# Altium schematic sheet Sheet1.SchDoc
size A3; PageSetup: Record=PageOptions|CenterHorizontal=True|CenterVertical=True|PrintScale=0.70|XCorrection=1.00|YCorrection=1.00|PrintKind=1|BorderSize=5000000|LeftOffset=0|BottomOffset=0|Orientation=2|PaperLength=1000|PaperWidth=1000|Scale=100|PaperSource=7|PrintQuality=-3|MediaType=1|DitherType=10|PrintScaleMode=1|PaperKind=Letter|PaperIndex=1
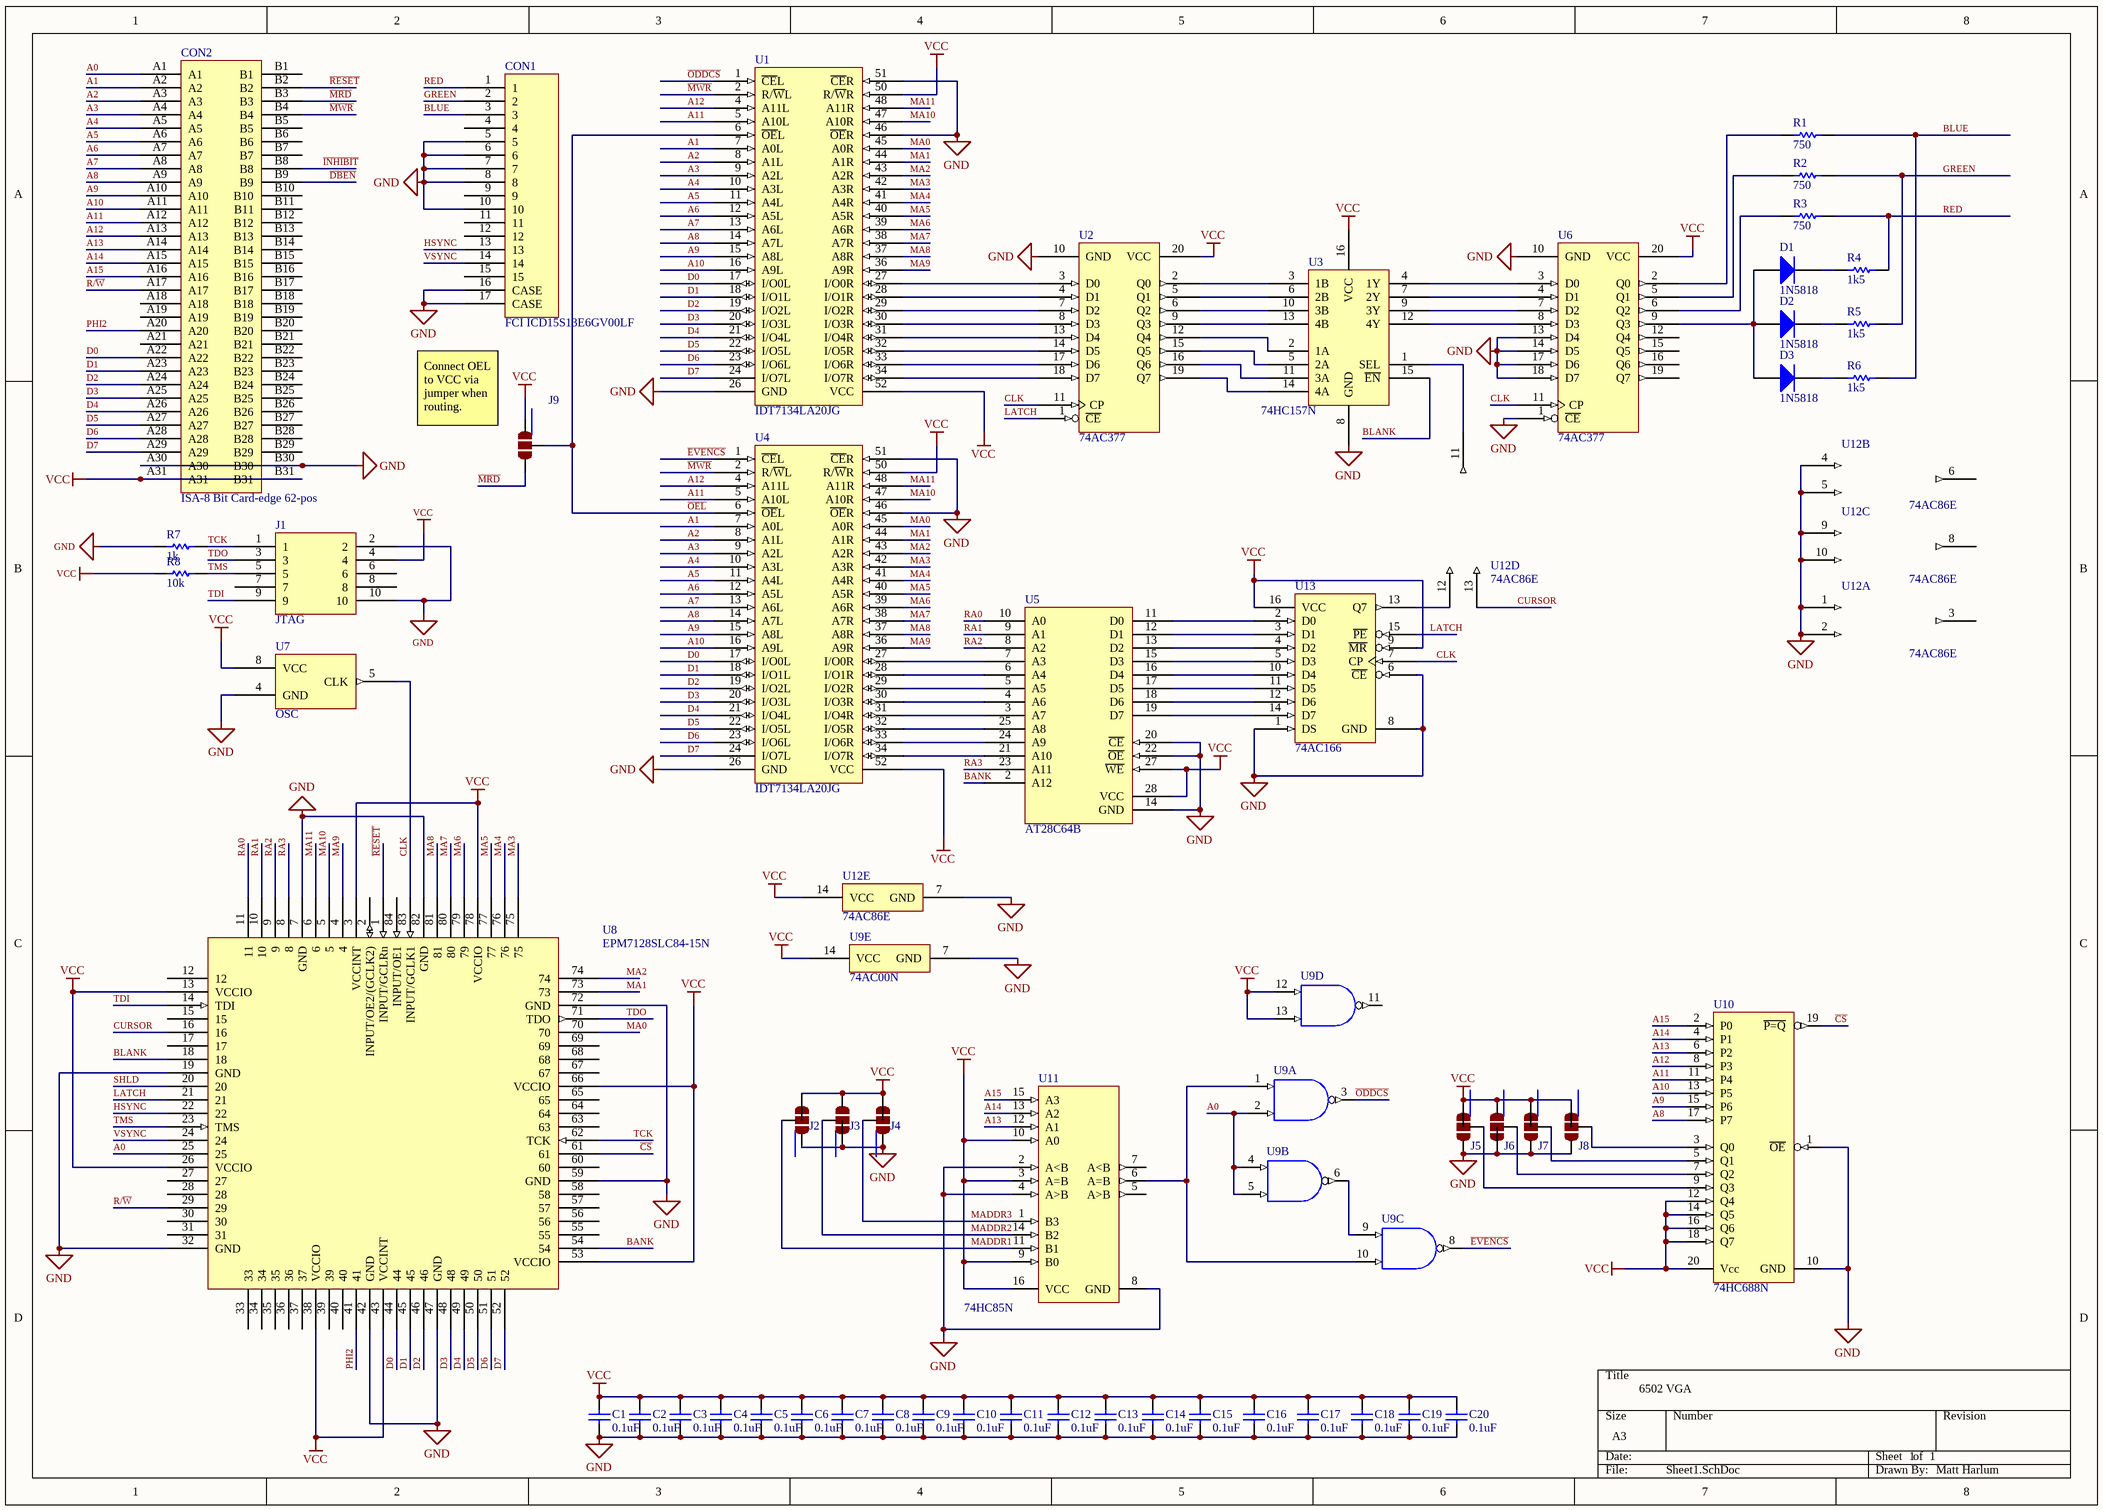
[diagram p0: Sheet1.SchDoc]

## Parts
(Parts that share a designator on the sheet are numbered #1, #2 ... from top to bottom, then left to right.)
C1  0.1uF  [PCB-axqyt61qy3lylbxfyoas-1]
C2  0.1uF  [PCB-axqyt61qy3lylbxfyoas-1]
C3  0.1uF  [PCB-axqyt61qy3lylbxfyoas-1]
C4  0.1uF  [PCB-axqyt61qy3lylbxfyoas-1]
C5  0.1uF  [PCB-axqyt61qy3lylbxfyoas-1]
C6  0.1uF  [PCB-axqyt61qy3lylbxfyoas-1]
C7  0.1uF  [PCB-axqyt61qy3lylbxfyoas-1]
C8  0.1uF  [PCB-axqyt61qy3lylbxfyoas-1]
C9  0.1uF  [PCB-axqyt61qy3lylbxfyoas-1]
C10  0.1uF  [PCB-axqyt61qy3lylbxfyoas-1]
C11  0.1uF  [CAPC1608X90X35LL15T15]
C12  0.1uF  [CAPC1608X90X35LL15T15]
C13  0.1uF  [CAPC1608X90X35LL15T15]
C14  0.1uF  [CAPC1608X90X35LL15T15]
C15  0.1uF  [CAPC1608X90X35LL15T15]
C16  0.1uF  [CAPC1608X90X35LL15T15]
C17  0.1uF  [CAPC1608X90X35LL15T15]
C18  0.1uF  [CAPC1608X90X35LL15T15]
C19  0.1uF  [PCB-axqyt61qy3lylbxfyoas-1]
C20  0.1uF  [PCB-axqyt61qy3lylbxfyoas-1]
CON1  FCI ICD15S13E6GV00LF  [PCB-aanmvvjyo9awk9gcg6zf-1]
CON2  ISA-8 Bit Card-edge 62-pos  [PCB-2hkdxqdttofatkmr091c-1]
D1  1N5818  [PCB-dmqzmbtm0hfd5zoh45h0-1]
D2  1N5818  [PCB-dmqzmbtm0hfd5zoh45h0-1]
D3  1N5818  [PCB-dmqzmbtm0hfd5zoh45h0-1]
J1  JTAG  [PCB-nsgmebcr356so910k4yq-1]
J2  Solder Jumper 2-way  [PCB-rrnqmtokqinrd1vbp5jt-1]  (value not drawn)
J3  Solder Jumper 2-way  [PCB-rrnqmtokqinrd1vbp5jt-1]  (value not drawn)
J4  Solder Jumper 2-way  [PCB-rrnqmtokqinrd1vbp5jt-1]  (value not drawn)
J5  Solder Jumper 2-way  [PCB-rrnqmtokqinrd1vbp5jt-1]  (value not drawn)
J6  Solder Jumper 2-way  [PCB-rrnqmtokqinrd1vbp5jt-1]  (value not drawn)
J7  Solder Jumper 2-way  [PCB-rrnqmtokqinrd1vbp5jt-1]  (value not drawn)
J8  Solder Jumper 2-way  [PCB-rrnqmtokqinrd1vbp5jt-1]  (value not drawn)
J9  Solder Jumper 2-way  [PCB-rrnqmtokqinrd1vbp5jt-1]  (value not drawn)
R1  750  [PCB-rpsft8201oy38h4ywt2t-1]
R2  750  [PCB-rpsft8201oy38h4ywt2t-1]
R3  750  [PCB-rpsft8201oy38h4ywt2t-1]
R4  1k5  [PCB-rpsft8201oy38h4ywt2t-1]
R5  1k5  [PCB-rpsft8201oy38h4ywt2t-1]
R6  1k5  [PCB-rpsft8201oy38h4ywt2t-1]
R7  1k  [PCB-rpsft8201oy38h4ywt2t-1]
R8  10k  [PCB-rpsft8201oy38h4ywt2t-1]
U1  IDT7134LA20JG  [PCB-4uhgbu29r3u9nc1ivwpw-1]
U2  74AC377  [SOIC-20]
U3  74HC157N  [PCB-8geuhk1ja2dgvs6cgerq-1]
U4  IDT7134LA20JG  [PCB-4uhgbu29r3u9nc1ivwpw-1]
U5  AT28C64B  [PCB-0g11s820xjhkjlfxzqv3-1]
U6  74AC377  [SOIC-20]
U7  OSC  [PCBComponent_1 - duplicate]
U8  EPM7128SLC84-15N  [PCB-0riewn8x9vsccxvjjlmn-1]
U9#1  74AC00N  [PCB-iqlzed4p26o3dln4s1xn-1]  (part E of 5)
U9#2  74AC00N  [PCB-iqlzed4p26o3dln4s1xn-1]  (value not drawn)  (parts A,B,C,D of 5)
U10  74HC688N  [PCB-uzpsivvelhpmz77y3dnk-1]
U11  74HC85N  [PCB-643w3ptt8l5hopz8bmjx-1]
U12  74AC86E  [DIP14]  (parts A,B,C,D,E of 5)
U13  74AC166  [DIP16]

## Nets
GND: C1.1 C2.1 C3.1 C4.1 C5.1 C6.1 C7.1 C8.1 C9.1 C10.1 C11.1 C12.1 C13.1 C14.1 C15.1 C16.1 C17.1 C18.1 C19.1 C20.1 CON1.5 CON1.6 CON1.7 CON1.8 CON1.10 CON1.16(CASE) CON1.17(CASE) CON2.A30 CON2.B30 J1.2 J1.10 J2.1 J3.1 J4.1 J5.3 J6.3 J7.3 J8.3 R7.1 U1.26(GND) U1.46(~{OE}R) U1.51(~{CE}R) U2.10(GND) U3.8(GND) U4.26(GND) U4.46(~{OE}R) U4.51(~{CE}R) U5.14(GND) U5.20(~{CE}) U5.22(~{OE}) U6.1(~{CE}) U6.10(GND) U6.13(D4) U6.14(D5) U6.17(D6) U6.18(D7) U7.4(GND) U8.7(GND) U8.19(GND) U8.32(GND) U8.42(GND) U8.47(GND) U8.59(GND) U8.72(GND) U8.82(GND) U9#1.7(GND) U10.1(~{OE}) U10.10(GND) U11.2(A<B) U11.4(A>B) U11.8(GND) U12.1(1A) U12.2(1B) U12.4(2A) U12.5(2B) U12.7(GND) U12.9(3A) U12.10(3B) U13.1(DS) U13.6(~{CE}) U13.8(GND)
VCC: C1.2 C2.2 C3.2 C4.2 C5.2 C6.2 C7.2 C8.2 C9.2 C10.2 C11.2 C12.2 C13.2 C14.2 C15.2 C16.2 C17.2 C18.2 C19.2 C20.2 CON2.A31 CON2.B31 J1.4 J2.3 J3.3 J4.3 J5.1 J6.1 J7.1 J8.1 J9.1 R8.1 U1.50(R/~{W}R) U1.52(VCC) U2.20(VCC) U3.16(VCC) U4.50(R/~{W}R) U4.52(VCC) U5.27(~{WE}) U5.28(VCC) U6.20(VCC) U7.8(VCC) U8.3(VCCINT) U8.13(VCCIO) U8.26(VCCIO) U8.38(VCCIO) U8.43(VCCINT) U8.53(VCCIO) U8.66(VCCIO) U8.78(VCCIO) U9#1.14(VCC) U9#2.12(4A) U9#2.13(4B) U10.12(Q4) U10.14(Q5) U10.16(Q6) U10.18(Q7) U10.20(Vcc) U11.3(A=B) U11.9(B0) U11.10(A0) U11.16(VCC) U12.14(VCC) U13.9(~{MR}) U13.16(VCC)
A0: CON2.A1 U8.25 U9#2.2(1B) U9#2.4(2A) U9#2.5(2B)
A1: CON2.A2 U1.7(A0L) U4.7(A0L)
A2: CON2.A3 U1.8(A1L) U4.8(A1L)
A3: CON2.A4 U1.9(A2L) U4.9(A2L)
A4: CON2.A5 U1.10(A3L) U4.10(A3L)
A5: CON2.A6 U1.11(A4L) U4.11(A4L)
A6: CON2.A7 U1.12(A5L) U4.12(A5L)
A7: CON2.A8 U1.13(A6L) U4.13(A6L)
A8: CON2.A9 U1.14(A7L) U4.14(A7L) U10.17(P7)
A9: CON2.A10 U1.15(A8L) U4.15(A8L) U10.15(P6)
A10: CON2.A11 U1.16(A9L) U4.16(A9L) U10.13(P5)
A11: CON2.A12 U1.5(A10L) U4.5(A10L) U10.11(P4)
A12: CON2.A13 U1.4(A11L) U4.4(A11L) U10.8(P3)
A13: CON2.A14 U10.6(P2) U11.12(A1)
A14: CON2.A15 U10.4(P1) U11.13(A2)
A15: CON2.A16 U10.2(P0) U11.15(A3)
BANK: U5.2(A12) U8.54
BLANK: U3.15(~{EN}) U8.18
BLUE: CON1.3 R1.2 R6.2
~{CS}: U8.61 U10.19(~{P=Q})
CLK: U2.11(CP) U6.11(CP) U7.5(CLK) U8.83(INPUT/GCLK1) U13.7(CP)
CURSOR: U8.16 U12.13(4B)
D0: CON2.A22 U1.17(I/O0L) U4.17(I/O0L) U8.44
D1: CON2.A23 U1.18(I/O1L) U4.18(I/O1L) U8.45
D2: CON2.A24 U1.19(I/O2L) U4.19(I/O2L) U8.46
D3: CON2.A25 U1.20(I/O3L) U4.20(I/O3L) U8.48
D4: CON2.A26 U1.21(I/O4L) U4.21(I/O4L) U8.49
D5: CON2.A27 U1.22(I/O5L) U4.22(I/O5L) U8.50
D6: CON2.A28 U1.23(I/O6L) U4.23(I/O6L) U8.51
D7: CON2.A29 U1.24(I/O7L) U4.24(I/O7L) U8.52
~{DBEN}: CON2.B9
~{EVENCS}: U4.1(~{CE}L) U9#2.8(~{3Y})
GREEN: CON1.2 R2.2 R5.2
HSYNC: CON1.13 U8.22
~{INHIBIT}: CON2.B8
LATCH: U2.1(~{CE}) U8.21 U13.15(~{PE})
~{MRD}: CON2.B3 J9.3
~{MWR}: CON2.B4 U1.2(R/~{W}L) U4.2(R/~{W}L)
MA0: U1.45(A0R) U4.45(A0R) U8.70
MA1: U1.44(A1R) U4.44(A1R) U8.73
MA2: U1.43(A2R) U4.43(A2R) U8.74
MA3: U1.42(A3R) U4.42(A3R) U8.75
MA4: U1.41(A4R) U4.41(A4R) U8.76
MA5: U1.40(A5R) U4.40(A5R) U8.77
MA6: U1.39(A6R) U4.39(A6R) U8.79
MA7: U1.38(A7R) U4.38(A7R) U8.80
MA8: U1.37(A8R) U4.37(A8R) U8.81
MA9: U1.36(A9R) U4.36(A9R) U8.4
MA10: U1.47(A10R) U4.47(A10R) U8.5
MA11: U1.48(A11R) U4.48(A11R) U8.6
MADDR1: J2.2 U11.11(B1)
MADDR2: J3.2 U11.14(B2)
MADDR3: J4.2 U11.1(B3)
~{ODDCS}: U1.1(~{CE}L) U9#2.3(~{1Y})
~{OEL}: J9.2 U1.6(~{OE}L) U4.6(~{OE}L)
PHI2: CON2.A20 U8.41
R/~{W}: CON2.A17 U8.29
~{RESET}: CON2.B2 U8.1(INPUT/GCLRn)
RA0: U5.10(A0) U8.11
RA1: U5.9(A1) U8.10
RA2: U5.8(A2) U8.9
RA3: U5.23(A11) U8.8
RED: CON1.1 R3.2 R4.2
SHLD: U8.20
TCK: J1.1 R7.2 U8.62(TCK)
TDI: J1.9 U8.14(TDI)
TDO: J1.3 U8.71(TDO)
TMS: J1.5 R8.2 U8.23(TMS)
VSYNC: CON1.14 U8.24
NetD1_1: D1.1(A) D2.1(A) D3.1(A) U6.9(Q3)
NetD1_2: D1.2(K) R4.1
NetD2_2: D2.2(K) R5.1
NetD3_2: D3.2(K) R6.1
NetJ5_2: J5.2 U10.9(Q3)
NetJ6_2: J6.2 U10.7(Q2)
NetJ7_2: J7.2 U10.5(Q1)
NetJ8_2: J8.2 U10.3(Q0)
NetR1_1: R1.1 U6.2(Q0)
NetR2_1: R2.1 U6.5(Q1)
NetR3_1: R3.1 U6.6(Q2)
NetU1_27: U1.27(I/O0R) U2.3(D0)
NetU1_28: U1.28(I/O1R) U2.4(D1)
NetU1_29: U1.29(I/O2R) U2.7(D2)
NetU1_30: U1.30(I/O3R) U2.8(D3)
NetU1_31: U1.31(I/O4R) U2.13(D4)
NetU1_32: U1.32(I/O5R) U2.14(D5)
NetU1_33: U1.33(I/O6R) U2.17(D6)
NetU1_34: U1.34(I/O7R) U2.18(D7)
NetU2_2: U2.2(Q0) U3.3(1B)
NetU2_5: U2.5(Q1) U3.6(2B)
NetU2_6: U2.6(Q2) U3.10(3B)
NetU2_9: U2.9(Q3) U3.13(4B)
NetU2_12: U2.12(Q4) U3.2(1A)
NetU2_15: U2.15(Q5) U3.5(2A)
NetU2_16: U2.16(Q6) U3.11(3A)
NetU2_19: U2.19(Q7) U3.14(4A)
NetU3_1: U3.1(SEL) U12.11(4Y)
NetU3_4: U3.4(1Y) U6.3(D0)
NetU3_7: U3.7(2Y) U6.4(D1)
NetU3_9: U3.9(3Y) U6.7(D2)
NetU3_12: U3.12(4Y) U6.8(D3)
NetU4_27: U4.27(I/O0R) U5.7(A3)
NetU4_28: U4.28(I/O1R) U5.6(A4)
NetU4_29: U4.29(I/O2R) U5.5(A5)
NetU4_30: U4.30(I/O3R) U5.4(A6)
NetU4_31: U4.31(I/O4R) U5.3(A7)
NetU4_32: U4.32(I/O5R) U5.25(A8)
NetU4_33: U4.33(I/O6R) U5.24(A9)
NetU4_34: U4.34(I/O7R) U5.21(A10)
NetU5_11: U5.11(D0) U13.2(D0)
NetU5_12: U5.12(D1) U13.3(D1)
NetU5_13: U5.13(D2) U13.4(D2)
NetU5_15: U5.15(D3) U13.5(D3)
NetU5_16: U5.16(D4) U13.10(D4)
NetU5_17: U5.17(D5) U13.11(D5)
NetU5_18: U5.18(D6) U13.12(D6)
NetU5_19: U5.19(D7) U13.14(D7)
NetU9#2_1: U9#2.1(1A) U9#2.10(3B) U11.6(A=B)
NetU9#2_6: U9#2.6(~{2Y}) U9#2.9(3A)
NetU12_12: U12.12(4A) U13.13(Q7)

Not connected (* = marked no-connect by the designer): CON1 4 9 11 12 15; CON2 A18 A19 A21 B1 B5 B6 B7 B10 B11 B12 B13 B14 B15 B16 B17 B18 B19 B20 B21 B22 B23 B24 B25 B26 B27 B28 B29; J1 6 7 8; U1 3(NC) 25(NC) 35(NC) 49(NC); U4 3(NC) 25(NC) 35(NC) 49(NC); U5 1(NC) 26(NC); U6 12(Q4) 15(Q5) 16(Q6) 19(Q7); U7 1(NC); U8 2(INPUT/OE2/(GCLK2)) 12 15 17 27 28 30 31 33 34 35 36 37 39 40 55 56 57 58 60 63 64 65 67 68 69 84(INPUT/OE1); U9#2 11(~{4Y}); U11 5(A>B) 7(A<B); U12 3(1Y) 6(2Y) 8(3Y)

## Notes on the sheet
- (near J9) Connect OEL to VCC via jumper when routing.
- 6502 VGA
- 1
- Matt Harlum

## Library data of the parts
C1-C10 C19 C20 = CMP-e4d32f8040453b14-8: Multilayer Ceramic Capacitor, Gold Max, C320 Series, 0.1 - F, - 10%, X7R, 50 V, Radial Leaded; Manufacturer Part Number: C320C104K5R5TA; Voltage Rating (DC): 50.0 V; Capacitance: 100 nF; Mounting Style: Radial; Dielectric Characteristic: X7R; REACH SVHC Compliance: No SVHC; RoHS: Compliant; Packaging: Bulk; Size-Height: 6.60 mm; Capacitance Tolerance: ±10%; Size-Length: 5.08 mm; OctopartID: e4d32f8040453b14
C11-C18 = CMP-15328962-11: 0603 0.1uF Capacitor; Insulation Resistance: 1e+11 Ω; Voltage Rating (DC): 16.0 V; Lead-Free Status: Lead Free; Dielectric Material: Ceramic Multilayer; Dielectric Characteristic: X7R; Capacitance Tolerance: ±10%; Capacitance: 1e-07 F; OctopartID: 0cd5c6920958d312; Number of Pins: 2; Size-Length: 0.0016002 m; Octopart Url: https://octopart.com/0603yc104kat2a-avx+interconnect+%2F+elco-55386347; Size-Height: 0.00086 m; Case/Package: 0603; REACH SVHC Compliance: No SVHC; RoHS: Compliant; Mounting Style: Surface Mount; Size-Width: 0.0008128 m
CON1 = CMP-7e34b562618ca1f3-2: Conn High Density D-Sub SKT 15 POS 2.28mm Solder RA Thru-Hole 15 Terminal 1 Port; Number of Positions: 15; Number of Mating Cycles: 500; Pin Pitch: 2.54 mm; Contact Resistance: 25.0 mΩ (max); Insulation Resistance: 5.00 GΩ (min); Lead-Free Status: Lead Free; Housing Material: Plastic; Flammability Rating: UL 94 V-0; Manufacturer Part Number: ICD15S13E6GV00LF; Number of Rows: 3; Packaging: Bulk; Contact Material: Copper Alloy; REACH SVHC Compliance: No SVHC; Operating Temperature: 125 °C (max); Contact Plating: Gold; OctopartID: 7e34b562618ca1f3; Size-Height: 12.6 mm; Number of Contacts: 15; Octopart URL: https://octopart.com/icd15s13e6gv00lf-fci-39598814; Size-Length: 30.8 mm
CON2 = CMP-azy0yq1pw9sh8verv59u-4: Card-Edge Male, 62 pos
D1-D3 = CMP-yuccqrbq8rh7itma33nv-1: DO-41 diode vertically mounted; CustomComponentID: yuccqrbq8rh7itma33nv
J1 = CMP-470a8e03b20998cd-2: Conn Shrouded Header HDR 10 POS 2.54mm Solder ST Thru-Hole C-Grid???? Tray; Manufacturer Part Number: 70246-1001; Gender: Male; Current Rating: 2.50 A; Number of Positions: 10; Insulation Resistance: 12.0 GΩ; ELV Compliant: Compliant; Voltage Rating (DC): 250 V; Size-Height: 9.27 mm; Packaging: Tray; Halogen Free Status: Not Low Halogen; Size-Width: 8.89 mm; Contact Plating: Gold; Color: Black; Number of Rows: 2; OctopartID: 470a8e03b20998cd; Octopart URL: http://octopart.com/70246-1001-molex-249957; RoHS: Compliant; Housing Material: Polyester; Housing Color: Black; Flammability Rating: UL 94 V-0; Pin Pitch: 2.54 mm; REACH SVHC Compliance: No SVHC; Mounting Style: Through Hole; Size-Length: 20.3 mm; Orientation: Vertical; Contact Material: Phosphor Bronze
J2-J9 = CMP-0rfjo47dqw9gp5mzow1m-3: SMD Jumper; CustomComponentID: 0rfjo47dqw9gp5mzow1m
R1-R3 R5 R6 R8 = CMP-7g9247jvdicm6feobieg-1: Generic through-hole resistor vertically mounted; CustomComponentID: 7g9247jvdicm6feobieg
R4 R7 = CMP-7g9247jvdicm6feobieg-1: CustomComponentID: 7g9247jvdicm6feobieg
U1 U4 = CMP-755abcdb4182aa9d-3: 4K x 8 DUAL-PORT STATIC SRAM; OctopartID: 755abcdb4182aa9d; Lifecycle Status: Not Listed by Manufacturer; Packaging: Tube; Octopart URL: http://octopart.com/idt7134la20jg-integrated+device+technology-9114046
U2 U6 = CMP-6bc3a2c42848b404-1: Flip Flop D-Type Bus Interface Pos-Edge 1-Element Automotive 20-Pin SOIC W Tube; Manufacturer Part Number: MC74AC377DWG; Lead-Free Status: Lead Free; Number of Bits: 8; Polarity: Non-Inverting; Supply Voltage (DC): 6.00 V (max); Octopart URL: https://octopart.com/mc74ac377dwg-on+semiconductor-878317; Case/Package: SOIC-W; Halogen Free Status: Halogen Free; Lifecycle Status: Active; Mounting Style: Surface Mount; Operating Temperature: 85.0 °C (max); Packaging: Rail; RoHS: Compliant; OctopartID: 6bc3a2c42848b404
U3 = CMP-211ce817b02ffedb-2: Logic IC - Multiplexer Texas Instruments SN74HC157N Multiplexer Single supply PDIP 16
U5 = CMP-2d70e7372d9bf2b7-4: AT28C64B Series 64 KB (8 K x 8) 5.5 V High-Performance Parallel EEPROM - DIP-28
U7 = CMP-6fd7a61dc048b010-4: Oscillator XO 5MHz ??50ppm 50pF (Stability) HCMOS/TTL 55% 5V 4-Pin Metal DIP Thru-Hole Tray; Lead-Free Status: Lead Free; Packaging: Tray; Case/Package: DIP; Mounting Style: Through Hole; RoHS: Compliant
U8 = CMP-a05d695118507f9a-3: CPLD MAX 7000 Family 2.5K Gates 128 Macro Cells 76.9MHz 5V 84-Pin PLCC; Lead-Free Status: Lead Free; Number of Outputs: 100; Manufacturer Part Number: EPM7128SLC84-15N; Mounting Style: Surface Mount; Packaging: Tube; Number of Pins: 84
U9#1 U9#2 = CMP-1698df952a8ec95f-5: Semiconductors and Actives, Logic Gates, Single, Logic, Standard
U10 = CMP-eae923e5462a352e-1: 8-Bit Identity/Magnitude Comparators (P=Q) with Enable 20-PDIP -40 to 85; OctopartID: eae923e5462a352e
U11 = CMP-79b0b0bcd5f4a677-1: Magnitude Comparator 4-Bit Non-Inverting 16-Pin PDIP Tube; Manufacturer Part Number: CD74HC85E; Operating Temperature: -55.0 °C to 125 °C; OctopartID: 79b0b0bcd5f4a677; Mounting Style: Through Hole; RoHS: Compliant; Number of Pins: 16; Lifecycle Status: Active
U12 = CMP-1f41d646b8bac086-1: XOR Gate 4-Element 2-IN CMOS 14-Pin PDIP Tube; Manufacturer Part Number: CD74AC86E; Lead-Free Status: Lead Free; Number of Bits: 4; Output Current: 24.0 mA; Output Current Drive: -1.00 mA; Propagation Delay Max (tpd): 15.1 ns; Supply Voltage (DC): 1.50 V to 5.50 V; Voltage Nodes: 3.30 V, 5.00 V; Octopart URL: https://octopart.com/cd74ac86e-texas+instruments-885405; Case/Package: PDIP; Lifecycle Status: Active; Mounting Style: Through Hole; Number of Gates: 4; Operating Temperature: -55.0 °C to 125 °C; Packaging: Tube, Rail; Number of Pins: 14; REACH SVHC Compliance: No SVHC; RoHS: Compliant; OctopartID: 1f41d646b8bac086
U13 = CMP-26cbef5ec380f90c-1: Shift Register Single 8-Bit Serial/Parallel to Serial 16-Pin PDIP Bulk; Manufacturer Part Number: 74HC166N,652; Lead-Free Status: Lead Free; Octopart URL: https://octopart.com/74hc166n%2C652-nxp+semiconductors-10469421; Lifecycle Status: Not Listed by Manufacturer; Case/Package: DIP; Mounting Style: Through Hole; Packaging: Tube; RoHS: Compliant; OctopartID: 26cbef5ec380f90c